# Altium project WB55_board.PrjPcb (part 3 of 3)

## Sheet MCU_IO.SchDoc
size A4; SheetNumber: 3; SheetTotal: 3
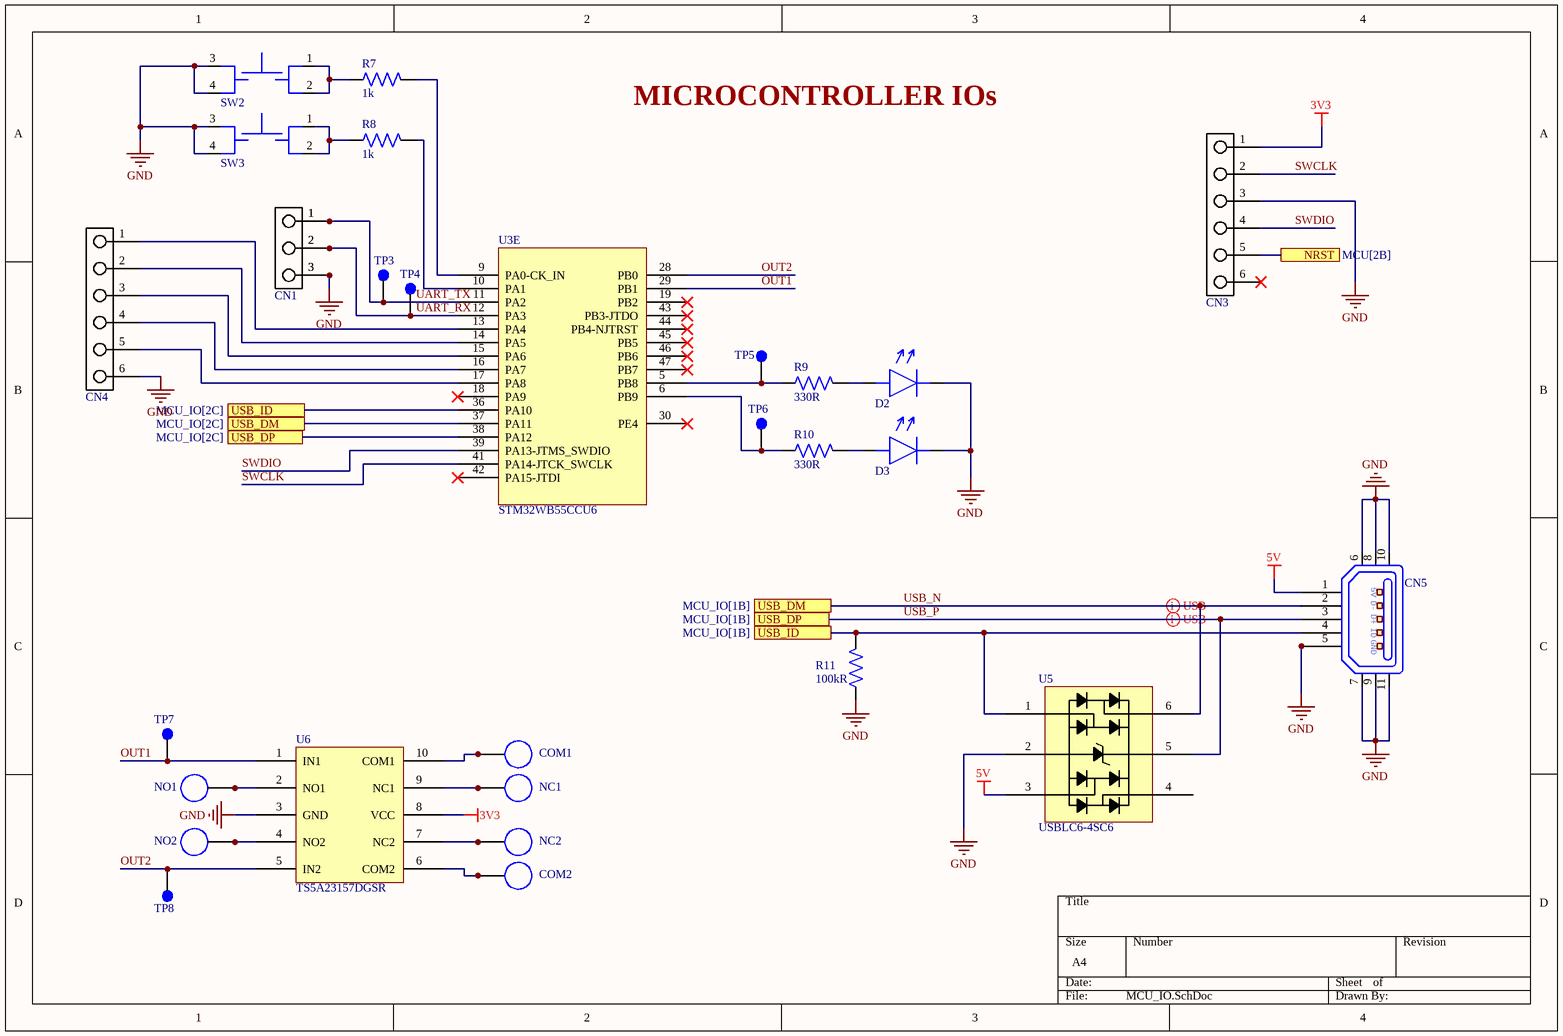
[diagram p2: MCU_IO.SchDoc]

### Parts
CN1  1x3 Header  [1x3Header]  (value not drawn)  (no BOM)
CN3  SSW-106-22-F-S-VS  [SSW-106-22-F-S-VS-K-TR]  (value not drawn)
CN4  90147-1306  [1x6Header]  (value not drawn)
CN5  MUSB-05-F-AB-SM-A-K  [USB]  (value not drawn)
COM1  Terminal  [2.5mmHOLE]  (value not drawn)  (no BOM)
COM2  Terminal  [2.5mmHOLE]  (value not drawn)  (no BOM)
D2  HSMS-C680  [LED]  (value not drawn)
D3  HSMS-C680  [LED]  (value not drawn)
NC1  Terminal  [2.5mmHOLE]  (value not drawn)  (no BOM)
NC2  Terminal  [2.5mmHOLE]  (value not drawn)  (no BOM)
NO1  Terminal  [2.5mmHOLE]  (value not drawn)  (no BOM)
NO2  Terminal  [2.5mmHOLE]  (value not drawn)  (no BOM)
R7  value 1k  [R0402]  (hidden comment: RC0402FR-071KL)
R8  value 1k  [R0402]  (hidden comment: RC0402FR-071KL)
R9  value 330R  [R0402]  (hidden comment: RC0402JR-13330RL)
R10  value 330R  [R0402]  (hidden comment: RC0402JR-13330RL)
R11  value 100kR  [R0402]  (hidden comment: RC0402JR-07100KL)
SW2  TS02-66-130-BK-260-LCR-D  [BUTTON]  (value not drawn)
SW3  TS02-66-130-BK-260-LCR-D  [BUTTON]  (value not drawn)
TP3  TP  [TP]  (value not drawn)  (no BOM)
TP4  TP  [TP]  (value not drawn)  (no BOM)
TP5  TP  [TP]  (value not drawn)  (no BOM)
TP6  TP  [TP]  (value not drawn)  (no BOM)
TP7  TP  [TP]  (value not drawn)  (no BOM)
TP8  TP  [TP]  (value not drawn)  (no BOM)
U3  STM32WB55CCU6  [WB55]  (part E of 5)
U5  USBLC6-4SC6  [SOT23-6]
U6  TS5A23157DGSR  [VSSOP10]

### Ports
NRST (see MCU[2B]), USB_DM (see MCU_IO[1B]), USB_DM (see MCU_IO[2C]), USB_DP (see MCU_IO[1B]), USB_DP (see MCU_IO[2C]), USB_ID (see MCU_IO[1B]), USB_ID (see MCU_IO[2C])

### Nets
3V3: CN3.1 U6.8(VCC)
5V: CN5.1 U5.3
GND: CN1.3 CN3.3 CN4.6 CN5.5 CN5.6 CN5.7 CN5.8 CN5.9 CN5.10 CN5.11 D2.2 D3.2 R11.1 SW2.3 SW2.4 SW3.3 SW3.4 U5.2(GND) U6.3(GND)
OUT1: TP7.1 U3.29(PB1) U6.1(IN1)
OUT2: TP8.1 U3.28(PB0) U6.5(IN2)
SWCLK: CN3.2 U3.41(PA14-JTCK_SWCLK)
SWDIO: CN3.4 U3.39(PA13-JTMS_SWDIO)
UART_RX: CN1.2 TP4.1 U3.12(PA3)
UART_TX: CN1.1 TP3.1 U3.11(PA2)
USB_N: CN5.2 U3.37(PA11) U5.6 ; port USB_DM
USB_P: CN5.3 U3.38(PA12) U5.5 ; port USB_DP
NetCN3_5: CN3.5 ; port NRST
NetCN4_1: CN4.1 U3.13(PA4)
NetCN4_2: CN4.2 U3.14(PA5)
NetCN4_3: CN4.3 U3.15(PA6)
NetCN4_4: CN4.4 U3.16(PA7)
NetCN4_5: CN4.5 U3.17(PA8)
NetCN5_4: CN5.4 R11.2 U3.36(PA10) U5.1 ; port USB_ID
NetCOM1_1: COM1.1 U6.10(COM1)
NetCOM2_1: COM2.1 U6.6(COM2)
NetD2_1: D2.1 R9.2
NetD3_1: D3.1 R10.2
NetNC1_1: NC1.1 U6.9(NC1)
NetNC2_1: NC2.1 U6.7(NC2)
NetNO1_1: NO1.1 U6.2(NO1)
NetNO2_1: NO2.1 U6.4(NO2)
NetR7_1: R7.1 SW2.1 SW2.2
NetR7_2: R7.2 U3.9(PA0-CK_IN)
NetR8_1: R8.1 SW3.1 SW3.2
NetR8_2: R8.2 U3.10(PA1)
NetR9_1: R9.1 TP5.1 U3.5(PB8)
NetR10_1: R10.1 TP6.1 U3.6(PB9)

Not connected (* = marked no-connect by the designer): CN3 6*; U3 18(PA9)* 19(PB2)* 30(PE4)* 42(PA15-JTDI)* 43(PB3-JTDO)* 44(PB4-NJTRST)* 45(PB5)* 46(PB6)* 47(PB7)*; U5 4

### Layout directives
differential pair: USB_N, USB_P

### Notes on the sheet
- MICROCONTROLLER IOs
- (in symbol MUSB-05-F-AB-SM-A-K) 5V; D-; D+; ID; GND

### Library data of the parts
CN3 = SSW-106-22-F-S-VS: Conn Socket Strip SKT 6 POS 2.54mm Solder ST SMD Tube; Manufacturer: Samtec; Number of Contacts: 6; Gender: Female; Mating Cycles: 100; Max Current Rating: 3A; Contact Resistance: 10mR; Supplier 1: Mouser; Manufacturer Part Number: SSW-106-22-F-S-VS; Stock 1: 0; Pricing 1: 1=1.41, 10=1.18, 50=1.18, 100=0.872, 250=0.785, 500=0.698, 1000=0.633, 2500=0.611, 5000=0.556, 10000=0.545 (USD); Contact Plating: Gold; Contact Material: Bronze; Color: Black; Housing Color: Black; Housing Material: Polymer; Min Operating Temperature: -55°C; Max Operating Temperature: 125°C; Number of Rows: 1; Termination: Solder; Packaging: Bulk; Orientation: Straight; Length: 15.75mm; Pitch: 2.54mm; Depth: 2.41mm; Radiation Hardening: No; Supplier Part Number 1: 200-SSW10622FSVS; ComponentLink1Description: Mouser Page; ComponentLink1URL: https://br.mouser.com/ProductDetail/Samtec/SSW-106-22-F-S-VS?qs=sGAEpiMZZMvffgRu4KC1RxM6nKwEP14AemsEUlRUVAFQwg4ur6pCqw%3D%3D; ComponentLink2Description: Datasheet; ComponentLink2URL: https://br.mouser.com/datasheet/2/527/ssw_sm-1370305.pdf; ComponentLink3Description: Samtec Page; ComponentLink3URL: https://www.samtec.com/products/ssw-106-22-f-s-vs; Category: Connectors
CN4 = 90147-1306: Header Connector, pcb Mount, plug, 6 Contacts, skt, 0.1 Pitch, pc Tail Terminal |Molex 90147-1306; Manufacturer: Molex; Plating: Tin; Current Rating: 3A; Voltage Rating: 350V; Number of Positions: 6; Number of Circuits: 5; Connector Type: Receptacle; Pitch: 2.54mm; Supplier: Digikey; Supplier Part Number: 0901471306-ND; Manufacturer Part Number: 90147-1306; RoHS: Yes; Category: Headers and Wire Housings; Pricing: 2880=1,37004 (USD); Contact Material: Bronze; Contact Plating: Gold; Housing Material: Polyester; Color: Black; Housing Color: Black; Min Operating Temperature: -55°C; Max Operating Temperature: 125°C; Packaging: Rail/Tube; Series: 90147; Package Quantity: 2880; Number of Rows: 1; Termination: Through Hole; Orientation: Vertical; Number of Contacts: 6; Length: 15.24mm; Depth: 2.54mm; RoHS Compliant: Yes; Reach SVHC Compliant: 4188SVHC; ComponentLink1URL: https://datasheet.ciiva.com/13558/0901471306-pcb-receptacles-176889-13558073.pdf?src-supplier=Mouser; ComponentLink1Description: https://datasheet.ciiva.com/13558/0901471306-pcb-receptacles-176889-13558073.pdf?src-supplier=Mouser; ComponentLink2URL: https://datasheet.ciiva.com/10085/0901471306-pcb-receptacles-10085019.pdf?src-supplier=Avnet; ComponentLink2Description: https://datasheet.ciiva.com/10085/0901471306-pcb-receptacles-10085019.pdf?src-supplier=Avnet
CN5 = MUSB-05-F-AB-SM-A-K: "Mini USB 2.0 Interface"; Manufacturer: Samtec; Supplier: Digikey; Supplier Part Number: 612-MUSB-05-F-AB-SM-A-K-ND; Manufacturer Part Number: MUSB-05-F-AB-SM-A-K; RoHS: No; Category: Connectors; Pricing: 1=1,56 (USD); RoHS Compliant: No; ComponentLink1URL: https://datasheet.octopart.com/MUSB-05-F-AB-SM-A-K-Samtec-datasheet-151555050.pdf?src-supplier=Sager+Electronics; ComponentLink1Description: https://datasheet.octopart.com/MUSB-05-F-AB-SM-A-K-Samtec-datasheet-151555050.pdf?src-supplier=Sager+Electronics; ComponentLink2URL: https://datasheet.octopart.com/MUSB-05-F-AB-SM-A-K-Samtec-datasheet-97180724.pdf?src-supplier=Samtec; ComponentLink2Description: https://datasheet.octopart.com/MUSB-05-F-AB-SM-A-K-Samtec-datasheet-97180724.pdf?src-supplier=Samtec; ComponentLink3URL: https://datasheet.octopart.com/MUSB-05-F-AB-SM-A-K-Samtec-datasheet-129014306.pdf?src-supplier=Electro+Sonic; ComponentLink3Description: https://datasheet.octopart.com/MUSB-05-F-AB-SM-A-K-Samtec-datasheet-129014306.pdf?src-supplier=Electro+Sonic
D2 D3 = HSMS-C680: LED Uni-Color Red 636nm 2-Pin Chip LED T/R; Manufacturer: Broadcom Avago; Lens Color: Colorless; Viewing Angle: 125°; Lens Style: Diffused,Colorless,Rectangular; Luminous Intensity: 5.1mcd; Forward Current: 20mA; Forward Voltage: 2V; Power Rating: 65mW; Lens Transparency: Clear; Dominant Wavelength: 621nm; Number of Elements: 1; Reverse Voltage: 5V; Supplier: Digikey; Supplier Part Number: 516-HSMS-C680CT-ND; Manufacturer Part Number: HSMS-C680; RoHS: Yes; Category: LEDs; Stock: 32975; Pricing: 1=0,41, 10=0,278, 100=0,1982, 500=0,16192, 1000=0,14996 (USD); Mounting Technology: Surface Mount; Case/Package: SMD/SMT; Pins: 2; Color: Red; Min Operating Temperature: -40°C; Max Operating Temperature: 85°C; Package Quantity: 3000; Packaging: Tape and Reel; Illumination Color: Red; Test Current: 20mA; Power Dissipation: 65mW; Wavelength: 621nm; Number of LEDs: 1; Series: -; Length: 3mm; Width: 1mm; Height: 1mm; Depth: 1mm; Radiation Hardening: No; Lead Free: Lead Free; RoHS Compliant: Yes; ComponentLink1URL: http://components.arrow.com/part/dataview/42989512S8356275N7786?src-supplier=Arrow+Electronics; ComponentLink1Description: http://components.arrow.com/part/dataview/42989512S8356275N7786?src-supplier=Arrow+Electronics; ComponentLink2URL: https://docs.broadcom.com/docs/AV02-0481EN?src-supplier=Digikey; ComponentLink2Description: https://docs.broadcom.com/docs/AV02-0481EN?src-supplier=Digikey; ComponentLink3URL: http://www.avagotech.com/docs/AV02-0481EN?src-supplier=Avnet; ComponentLink3Description: http://www.avagotech.com/docs/AV02-0481EN?src-supplier=Avnet; ComponentLink4URL: http://www.avagotech.com/docs/AV02-0481EN?src-supplier=Mouser; ComponentLink4Description: http://www.avagotech.com/docs/AV02-0481EN?src-supplier=Mouser
R7 R8 = RC0402FR-071KL: SMD Chip Resistor 1 Kohm ½ 1% 62.5 Mw 0402 [1005 Metric] Thick Film General Purpose; Manufacturer: Yageo; Voltage Rating (DC): 50V; Temperature Coefficient: 100ppm/°C; Power Rating: 62.5mW; Max Power Dissipation: 63mW; Supplier: Avnet; Supplier Part Number: RC0402FR-071KL; Manufacturer Part Number: RC0402FR-071KL; RoHS: Yes; Category: Chip SMD Resistors; Stock: 9660000; Pricing: 10000=0,00097, 20000=0,00093, 40000=0,0009, 60000=0,00087, 80000=0,00084 (USD); Case/Package: 0402; Pins: 2; Case Code (Imperial): 0402; Case Code (Metric): 1005; Min Operating Temperature: -55°C; Max Operating Temperature: 155°C; Tolerance: 1%; Packaging: Tape and Reel; Voltage Rating: 50V; Termination: SMD/SMT; Voltage Rating (AC): 50V; Resistor Type: Thick Film; Features: Moisture Resistant; Series: RC; Number of Terminations: 2; Resistance Tolerance: 1%; Construction: Rectangular; Technology: THICK FILM; Length: 1mm; Width: 0.5mm; Height: 0.32mm; Depth: 0.5mm; Reach SVHC Compliant: No; Lead Free: Lead Free; Military Standard: Not; RoHS Compliant: Yes; ComponentLink1URL: https://datasheet.ciiva.com/11819/0900766b80c66297-11819477.pdf?src-supplier=Rs; ComponentLink1Description: https://datasheet.ciiva.com/11819/0900766b80c66297-11819477.pdf?src-supplier=Rs; ComponentLink2URL: https://datasheet.ciiva.com/7983/1018594-7983502.pdf?src-supplier=Element14; ComponentLink2Description: https://datasheet.ciiva.com/7983/1018594-7983502.pdf?src-supplier=Element14; ComponentLink3URL: https://datasheet.ciiva.com/22747/1018594-22747513.pdf?src-supplier=Element14; ComponentLink3Description: https://datasheet.ciiva.com/22747/1018594-22747513.pdf?src-supplier=Element14; ComponentLink4URL: https://datasheet.ciiva.com/17063/pyu-rc0402-51-rohs-l-6-r-17063193.pdf?src-supplier=Future+Electronics; ComponentLink4Description: https://datasheet.ciiva.com/17063/pyu-rc0402-51-rohs-l-6-r-17063193.pdf?src-supplier=Future+Electronics; ComponentLink5URL: https://datasheet.ciiva.com/7849/1018594-7849869.pdf?src-supplier=Element14; ComponentLink5Description: https://datasheet.ciiva.com/7849/1018594-7849869.pdf?src-supplier=Element14; ComponentLink6URL: https://datasheet.ciiva.com/7849/1018594-7849871.pdf?src-supplier=Element14; ComponentLink6Description: https://datasheet.ciiva.com/7849/1018594-7849871.pdf?src-supplier=Element14; ComponentLink7URL: https://datasheet.ciiva.com/12666/pyu-rc0402-51-rohs-l-6-r-12666741.pdf?src-supplier=Mouser; ComponentLink7Description: https://datasheet.ciiva.com/12666/pyu-rc0402-51-rohs-l-6-r-12666741.pdf?src-supplier=Mouser
R9 R10 = RC0402JR-13330RL: Res Thick Film 0402 330 Ohm 5% 1/16W ±100ppm/°C Molded SMD SMD Paper T/R; Manufacturer: Yageo; Power Rating: 63mW; Supplier: Digikey; Supplier Part Number: 13-RC0402JR-13330RLCT-ND; Manufacturer Part Number: RC0402JR-13330RL; RoHS: Yes; Category: Chip SMD Resistors; Stock: 107022; Pricing: 1=0,1, 10=0,006, 50=0,0056, 100=0,0051, 500=0,0046, 1000=0,00306, 5000=0,00246 (USD); Case/Package: 0402; Contact Plating: Tin,Matte; Min Operating Temperature: -55°C; Max Operating Temperature: 155°C; Tolerance: 5%; Temperature Coefficient: 100ppm/°C; Packaging: Tape and Reel; Construction: Rectangular; Length: 1mm; Depth: 0.5mm; Military Standard: Not; Lead Free: Lead Free; RoHS Compliant: Yes; ComponentLink1URL: https://datasheet.ciiva.com/17423/pyu-rc0402-51-rohs-l-6-r-17423686.pdf?src-supplier=Future+Electronics; ComponentLink1Description: https://datasheet.ciiva.com/17423/pyu-rc0402-51-rohs-l-6-r-17423686.pdf?src-supplier=Future+Electronics
R11 = RC0402JR-07100KL: SMD Chip Resistor, 100 Kohm, ½ 5%, 62.5 Mw, 0402 [1005 Metric], Thick Film, General Purpose; Manufacturer: Yageo; Voltage Rating: 50V; Power Rating: 62.5mW; Temperature Coefficient: 100ppm/°C; Max Power Dissipation: 63mW; Supplier: Future Electronics; Supplier Part Number: 4246625; Manufacturer Part Number: RC0402JR-07100KL; RoHS: Yes; Category: Chip SMD Resistors; Stock: 7850000; Pricing: 10000=0,0006, 50000=0,0006, 250000=0,0005, 500000=0,0005, 1500000=0,0005 (USD); Case/Package: 0402; Case Code (Metric): 1005; Case Code (Imperial): 0402; Min Operating Temperature: -55°C; Max Operating Temperature: 155°C; Packaging: Tape and Reel; Termination: SMD/SMT; Voltage Rating (AC): 50V; Tolerance: 5%; Resistor Type: Thick Film; Number of Terminations: 2; Features: Moisture Resistant; Series: RC; Resistance Tolerance: 5%; Construction: Rectangular; Length: 1mm; Depth: 0.5mm; Lead Free: Lead Free; Reach SVHC Compliant: Unknown; Military Standard: Not; RoHS Compliant: Yes; ComponentLink1URL: https://datasheet.ciiva.com/2491/pyu-r-int-thick-7-2491208.pdf?src-supplier=Digikey; ComponentLink1Description: https://datasheet.ciiva.com/2491/pyu-r-int-thick-7-2491208.pdf?src-supplier=Digikey; ComponentLink2URL: https://datasheet.ciiva.com/2491/pyu-r-int-thick-7-2491209.pdf?src-supplier=Digikey; ComponentLink2Description: https://datasheet.ciiva.com/2491/pyu-r-int-thick-7-2491209.pdf?src-supplier=Digikey; ComponentLink3URL: https://datasheet.ciiva.com/2491/pyu-r-int-thick-7-2491207.pdf?src-supplier=Digikey; ComponentLink3Description: https://datasheet.ciiva.com/2491/pyu-r-int-thick-7-2491207.pdf?src-supplier=Digikey; ComponentLink4URL: https://datasheet.ciiva.com/17052/pyu-rc0402-51-rohs-l-6-r-17052137.pdf?src-supplier=Future+Electronics; ComponentLink4Description: https://datasheet.ciiva.com/17052/pyu-rc0402-51-rohs-l-6-r-17052137.pdf?src-supplier=Future+Electronics; ComponentLink5URL: https://datasheet.ciiva.com/46394/1018594-46394941.pdf?src-supplier=Element14; ComponentLink5Description: https://datasheet.ciiva.com/46394/1018594-46394941.pdf?src-supplier=Element14; ComponentLink6URL: https://datasheet.ciiva.com/7850/1018594-7850133.pdf?src-supplier=Element14; ComponentLink6Description: https://datasheet.ciiva.com/7850/1018594-7850133.pdf?src-supplier=Element14; ComponentLink7URL: https://datasheet.ciiva.com/12668/pyu-rc0402-51-rohs-l-6-r-12668218.pdf?src-supplier=Mouser; ComponentLink7Description: https://datasheet.ciiva.com/12668/pyu-rc0402-51-rohs-l-6-r-12668218.pdf?src-supplier=Mouser
SW2 SW3 = TS02-66-130-BK-260-LCR-D: Manufacturer: Same Sky; Category: Tactile Switches; Manufacturer Part Number: TS02-66-130-BK-260-LCR-D
TP3-TP8 = TP: Test Point
U3 = STM32WB55CCU6: MCU 32-Bit STM32WB55 ARM Cortex-M4F RISC 256KB Flash 1.71V to 3.6V 48-Pin UFQFPN T/R; Manufacturer: STMicroelectronics; Interface: I2C,SPI,USB,UART,USART; Frequency: 2.48GHz; Data Rate: 2Mbps; Sensitivity: -100dBm; Current - Receiving: 7.9mA; Current - Transmitting: 12.7mA; Number of GPIO: 30; Supplier: Digikey; Supplier Part Number: 497-STM32WB55CCU6-ND; RoHS: Yes; Category: Microcontrollers; Stock: 2269; Pricing: 1=5,19, 10=3,989, 25=3,6896, 80=3,41638 (USD); Mounting Technology: Surface Mount; Case/Package: UFQFPN; Min Operating Temperature: -40°C; Max Operating Temperature: 105°C; Series: -; Memory Size: 256KB; ComponentLink1URL: https://www.st.com/resource/en/datasheet/stm32wb55cc.pdf?src-supplier=Digikey; ComponentLink1Description: https://www.st.com/resource/en/datasheet/stm32wb55cc.pdf?src-supplier=Digikey; Manufacturer Part Number: STM32WB55CCU6
U5 = USBLC6-4SC6: USBLC6 Series 4 Line 6 V Uni / Bi-Directional ESD Protection - SOT-23-6; Manufacturer: STMicroelectronics; Value: 4pF; Direction: Unidirectional; Number of Channels: 4; Reverse Standoff Voltage: 5V; Min Breakdown Voltage: 6V; Power Line Protection: Yes; Peak Pulse Current: 5A; Number of Elements: 1; Operating Supply Voltage: 860mV; Clamping Voltage: 17V; Polarity: Unidirectional,Bidirectional; Leakage Current: 150nA; Test Current: 1mA; Max Breakdown Voltage: 10V; Max Reverse Leakage Current: 2uA; Interface: 224,1515Interface; Peak Pulse Power: 130W; Supplier: Future Electronics; Supplier Part Number: 5949821; Manufacturer Part Number: USBLC6-4SC6; RoHS: Yes; Category: TVS Diodes; Stock: 1416000; Pricing: 3000=0,0692, 9000=0,0666, 15000=0,0654, 30000=0,0638, 60000=0,0614 (USD); Mounting Technology: Surface Mount; Case/Package: SOT-23; Pins: 6; Min Operating Temperature: -40°C; Max Operating Temperature: 125°C; Packaging: Tape and Reel; Breakdown Voltage: 6V; Series: USB; Reverse Breakdown Voltage: 6V; Termination: SMD/SMT; Working Voltage: 5V; ESD Protection: Yes; Voltage Rating (DC): 5V; Clamping Voltage-Max: 17V; Number of Unidirectional Channels: 4; Length: 3.05mm; Width: 1.75mm; Height: 1.3mm; Depth: 1.75mm; Radiation Hardening: No; Reach SVHC Compliant: No; Lead Free: Lead Free; RoHS Compliant: Yes; ComponentLink1URL: https://datasheet.ciiva.com/16206/cd00047494-16206119.pdf?src-supplier=Future+Electronics; ComponentLink1Description: https://datasheet.ciiva.com/16206/cd00047494-16206119.pdf?src-supplier=Future+Electronics; ComponentLink2URL: https://datasheet.ciiva.com/15143/getdatasheetpartid-88767-15143364.pdf?src-supplier=Verical; ComponentLink2Description: https://datasheet.ciiva.com/15143/getdatasheetpartid-88767-15143364.pdf?src-supplier=Verical; ComponentLink3URL: https://datasheet.ciiva.com/27052/1493951-27052291.pdf?src-supplier=Jameco; ComponentLink3Description: https://datasheet.ciiva.com/27052/1493951-27052291.pdf?src-supplier=Jameco; ComponentLink4URL: https://datasheet.ciiva.com/14186/usblc6-4-st-eng-tds-14186570.pdf?src-supplier=Distrelec; ComponentLink4Description: https://datasheet.ciiva.com/14186/usblc6-4-st-eng-tds-14186570.pdf?src-supplier=Distrelec; ComponentLink5URL: https://datasheet.ciiva.com/1220/48344-1220005.pdf?src-supplier=Newark; ComponentLink5Description: https://datasheet.ciiva.com/1220/48344-1220005.pdf?src-supplier=Newark; ComponentLink6URL: https://datasheet.ciiva.com/4507/cd00047494-112581-4507757.pdf?src-supplier=Mouser; ComponentLink6Description: https://datasheet.ciiva.com/4507/cd00047494-112581-4507757.pdf?src-supplier=Mouser; ComponentLink7URL: https://datasheet.ciiva.com/22685/1498406-22685833.pdf?src-supplier=Element14; ComponentLink7Description: https://datasheet.ciiva.com/22685/1498406-22685833.pdf?src-supplier=Element14; ComponentLink8URL: https://datasheet.ciiva.com/22692/1498406-22692454.pdf?src-supplier=Element14; ComponentLink8Description: https://datasheet.ciiva.com/22692/1498406-22692454.pdf?src-supplier=Element14
U6 = TS5A23157DGSR: Integrated Circuit Analog Switch; 5-V, 2: 1 (SPDT), 2-channel analog switch 10-VSSOP -40 to 125; Manufacturer: Texas Instruments; Max Supply Voltage: 5.5V; Min Supply Voltage: 1.8V; Number of Channels: 2; Bandwidth: 220MHz; Max Supply Current: 1uA; Supply Type: Single; Number of Outputs: 4; Supplier: Mouser; Supplier Part Number: 595-TS5A23157DGSR; Manufacturer Part Number: TS5A23157DGSR; RoHS: Yes; Category: Interface ICs; Stock: 25483; Pricing: 1=0,43, 10=0,297, 50=0,266, 100=0,23, 1000=0,194, 10000=0,177 (USD); Mounting Technology: Surface Mount; Case/Package: VSSOP; Pins: 10; Weight: 0.000663oz; Min Operating Temperature: -40°C; Max Operating Temperature: 85°C; Packaging: Tape and Reel; Series: -; Number of Inputs: 2; Number of Circuits: 2; -3db Bandwidth: 220MHz; Number of Bits: 2; Thickness: 1.02mm; Radiation Hardening: No; Lead Free: Lead Free; RoHS Compliant: Yes; Reach SVHC Compliant: Unknown; ComponentLink1URL: https://datasheet.ciiva.com/1670/ts5a23157-1670544.pdf?src-supplier=Digikey; ComponentLink1Description: https://datasheet.ciiva.com/1670/ts5a23157-1670544.pdf?src-supplier=Digikey; ComponentLink2URL: https://datasheet.ciiva.com/2978/ts5a23157-2978976.pdf?src-supplier=Avnet; ComponentLink2Description: https://datasheet.ciiva.com/2978/ts5a23157-2978976.pdf?src-supplier=Avnet; ComponentLink3URL: https://datasheet.ciiva.com/15127/getdatasheetpartid-249170-15127550.pdf?src-supplier=Verical; ComponentLink3Description: https://datasheet.ciiva.com/15127/getdatasheetpartid-249170-15127550.pdf?src-supplier=Verical; ComponentLink4URL: https://datasheet.ciiva.com/1670/ts5a23157-1670545.pdf?src-supplier=Digikey; ComponentLink4Description: https://datasheet.ciiva.com/1670/ts5a23157-1670545.pdf?src-supplier=Digikey; ComponentLink5URL: https://datasheet.ciiva.com/1670/ts5a23157-1670616.pdf?src-supplier=Digikey; ComponentLink5Description: https://datasheet.ciiva.com/1670/ts5a23157-1670616.pdf?src-supplier=Digikey; ComponentLink6URL: https://datasheet.ciiva.com/1514/1836502-1514585.pdf?src-supplier=Element14; ComponentLink6Description: https://datasheet.ciiva.com/1514/1836502-1514585.pdf?src-supplier=Element14; ComponentLink7URL: https://datasheet.ciiva.com/41675/1836502-41675240.pdf?src-supplier=Newark; ComponentLink7Description: https://datasheet.ciiva.com/41675/1836502-41675240.pdf?src-supplier=Newark

## Nets that join several sheets
3V3: PowerSupply (C7.2 TP2.1 U2.5), MCU (20 pins), MCU_IO (CN3.1 U6.8)
5V: PowerSupply (8 pins), MCU_IO (CN5.1 U5.3)
GND: PowerSupply (10 pins), MCU (30 pins), MCU_IO (19 pins)
NetCN3_5: MCU (D1.K), MCU_IO (CN3.5)

## Assembly variants
Prototype: not fitted CN1 CN3 CN4 R3 R13 X2